# EAGLE schematic RGB_Analog (EAGLE 7.5.0)
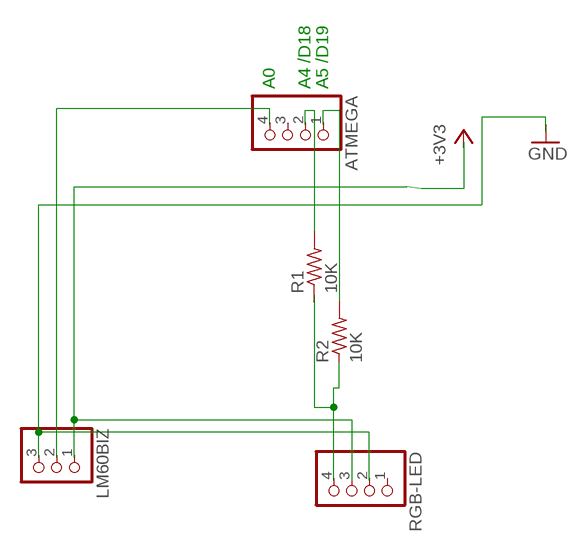
[diagram p0: schematic, sheet 1]

## Parts
ATMEGA  PINHD-1X4  [1X04]
LM60BIZ  PINHD-1X3  [1X03]
R1  10K  R-US_0207/7  [0207/7]
R2  10K  R-US_0207/7  [0207/7]
RGB-LED  PINHD-1X4  [1X04]

## Nets
N$3: R1.2
N$4: R2.2
Unconnected: ATMEGA.1 ATMEGA.2 ATMEGA.3 ATMEGA.4 LM60BIZ.1 LM60BIZ.2 LM60BIZ.3 R1.1 R2.1 RGB-LED.1 RGB-LED.2 RGB-LED.3 RGB-LED.4

## Notes on the sheet
- A0 | A4 /D18 | A5 /D19

## Library data of the parts
ATMEGA RGB-LED = pinhead:PINHD-1X4: PIN HEADER
LM60BIZ = pinhead:PINHD-1X3: PIN HEADER
R1 R2 = resistor:R-US_: RESISTOR, American symbol